# Altium project atWork_Encoder.PrjPcb
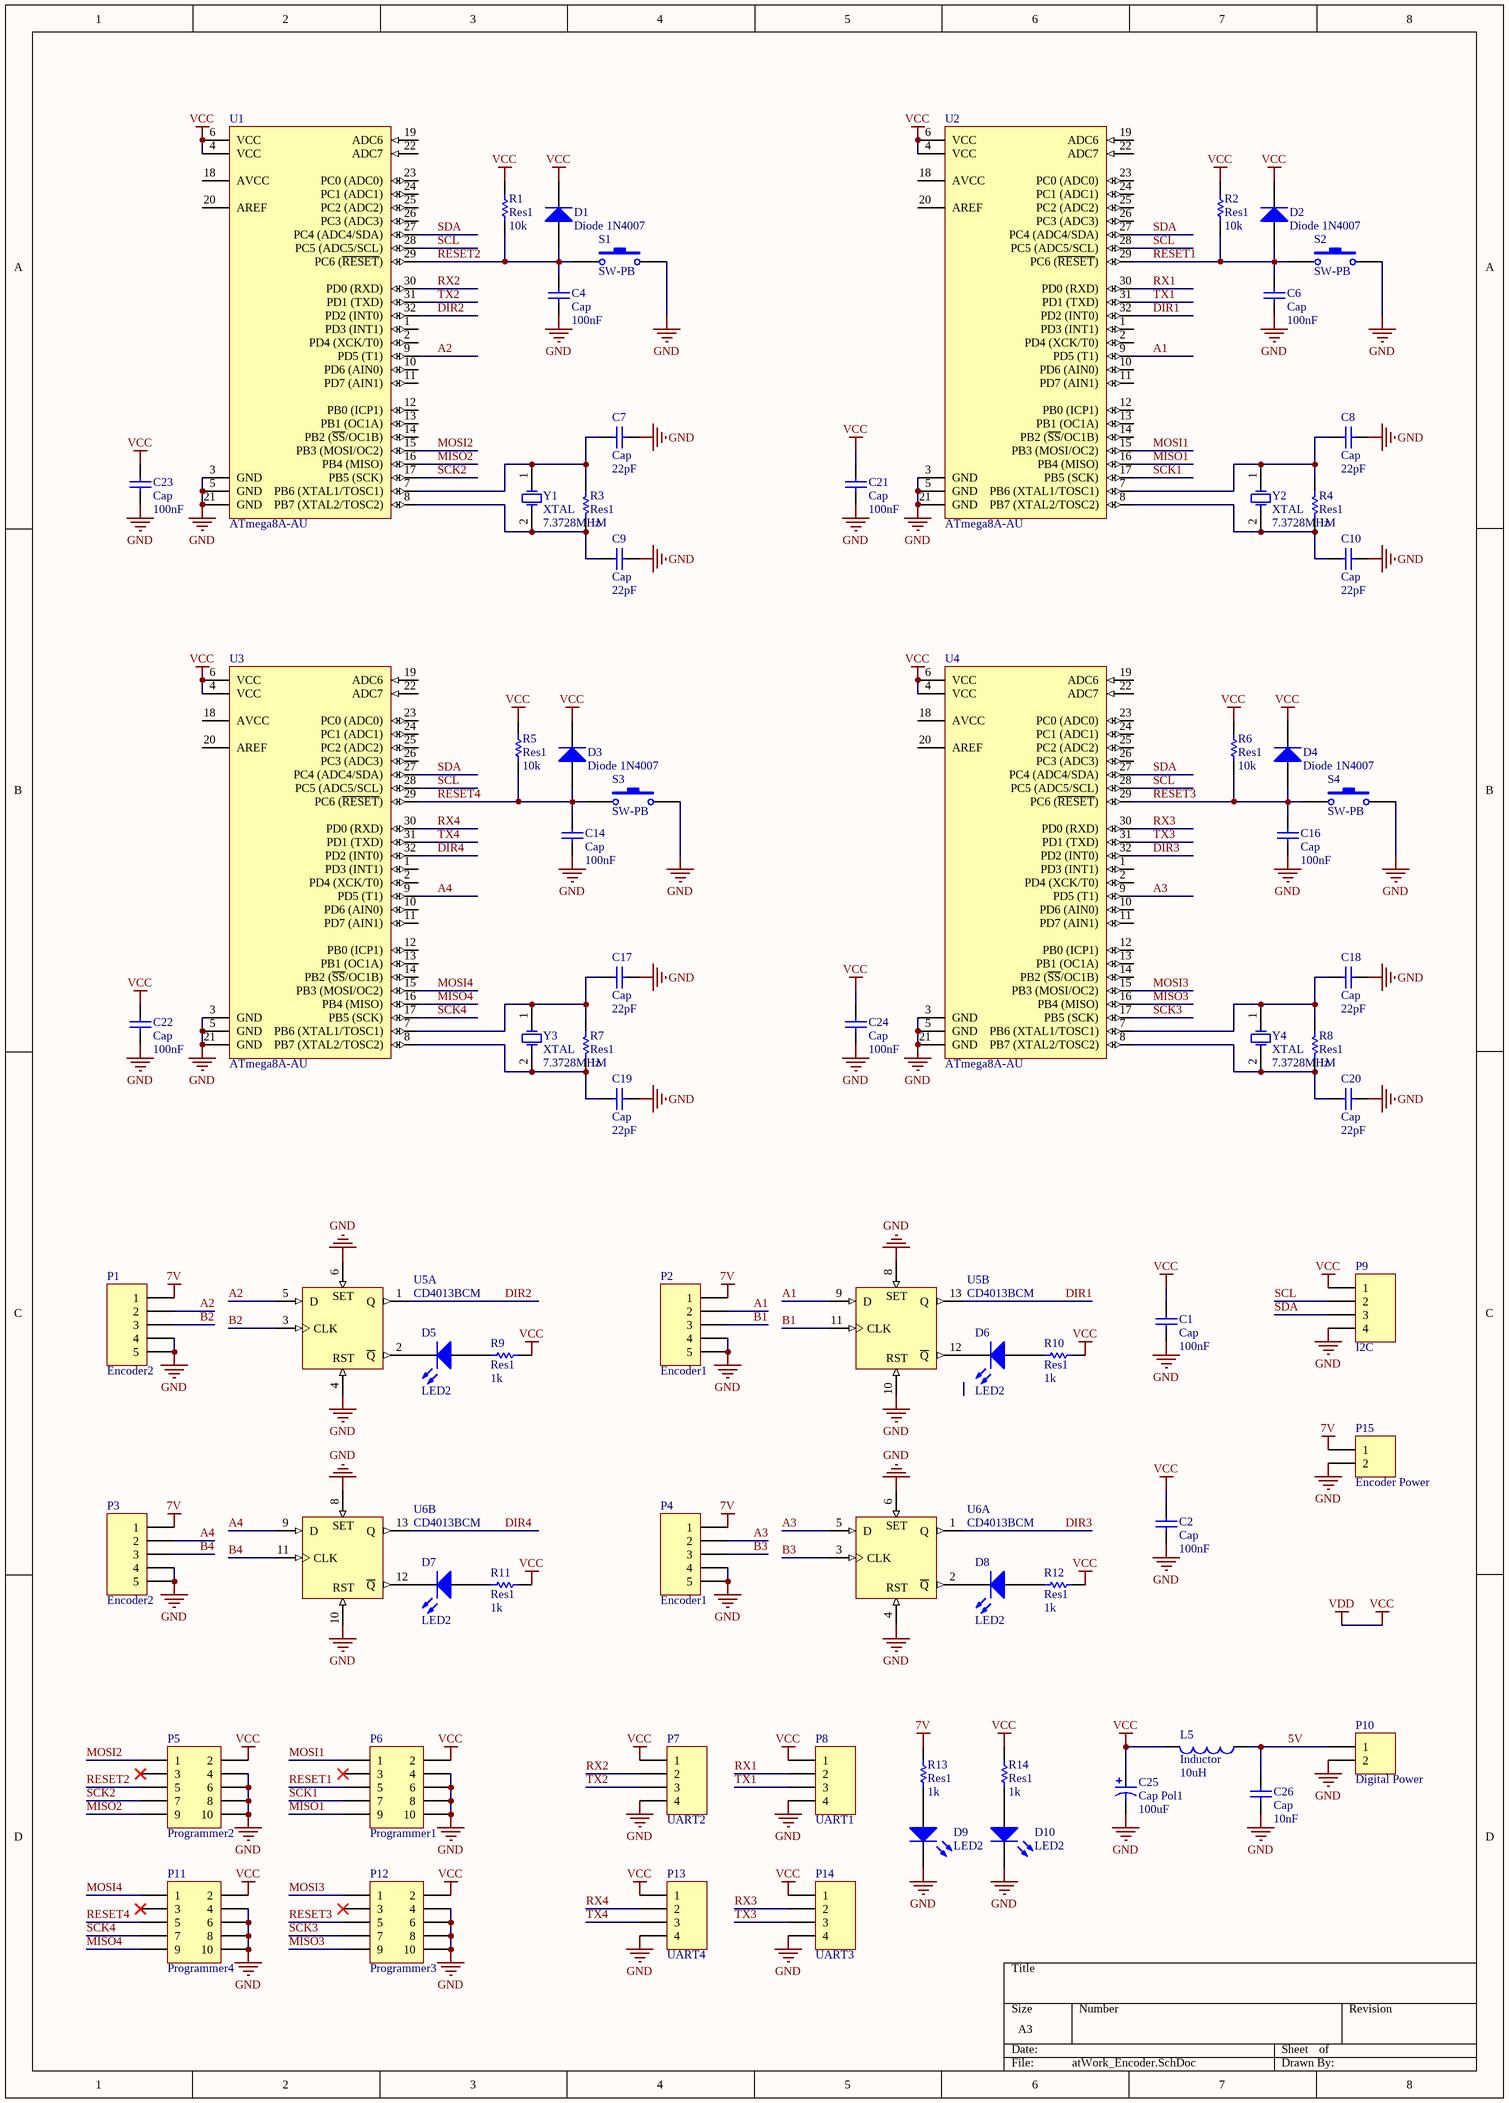
[diagram p0: atWork_Encoder.SchDoc]
1 sheet, 74 parts. Net scope: global (net labels, ports and power ports of the same name join across sheets).
Board file: atWork_Encoder.PcbDoc

## Sheet atWork_Encoder.SchDoc
size A3 portrait

### Parts
C1  Cap  value 100nF  [C1206]
C2  Cap  value 100nF  [C1206]
C4  Cap  value 100nF  [C1206]
C6  Cap  value 100nF  [C1206]
C7  Cap  value 22pF  [C1206]
C8  Cap  value 22pF  [C1206]
C9  Cap  value 22pF  [C1206]
C10  Cap  value 22pF  [C1206]
C14  Cap  value 100nF  [C1206]
C16  Cap  value 100nF  [C1206]
C17  Cap  value 22pF  [C1206]
C18  Cap  value 22pF  [C1206]
C19  Cap  value 22pF  [C1206]
C20  Cap  value 22pF  [C1206]
C21  Cap  value 100nF  [C1206]
C22  Cap  value 100nF  [C1206]
C23  Cap  value 100nF  [C1206]
C24  Cap  value 100nF  [C1206]
C25  Cap Pol1  value 100uF  [CAP-SMD1]
C26  Cap  value 10nF  [C1206]
D1  Diode 1N4007  [DIODE-SMD]
D2  Diode 1N4007  [DIODE-SMD]
D3  Diode 1N4007  [DIODE-SMD]
D4  Diode 1N4007  [DIODE-SMD]
D5  LED2  [3.2X1.6X1.1]
D6  LED2  [3.2X1.6X1.1]
D7  LED2  [3.2X1.6X1.1]
D8  LED2  [3.2X1.6X1.1]
D9  LED2  [3.2X1.6X1.1]
D10  LED2  [3.2X1.6X1.1]
L5  Inductor  value 10uH  [C1206]
P1  Encoder2  [XH5PIN]
P2  Encoder1  [XH5PIN]
P3  Encoder2  [XH5PIN]
P4  Encoder1  [XH5PIN]
P5  Programmer2  [BOX2X5]
P6  Programmer1  [BOX2X5]
P7  UART2  [XH4PIN]
P8  UART1  [XH4PIN]
P9  I2C  [XH4PIN]
P10  Digital Power  [XH2PIN]
P11  Programmer4  [BOX2X5]
P12  Programmer3  [BOX2X5]
P13  UART4  [XH4PIN]
P14  UART3  [XH4PIN]
P15  Encoder Power  [XH2PIN]
R1  Res1  value 10k  [C1206]
R2  Res1  value 10k  [C1206]
R3  Res1  value 1M  [C1206]
R4  Res1  value 1M  [C1206]
R5  Res1  value 10k  [C1206]
R6  Res1  value 10k  [C1206]
R7  Res1  value 1M  [C1206]
R8  Res1  value 1M  [C1206]
R9  Res1  value 1k  [C1206]
R10  Res1  value 1k  [C1206]
R11  Res1  value 1k  [C1206]
R12  Res1  value 1k  [C1206]
R13  Res1  value 1k  [C1206]
R14  Res1  value 1k  [C1206]
S1  SW-PB  [PUSH1]
S2  SW-PB  [PUSH1]
S3  SW-PB  [PUSH1]
S4  SW-PB  [PUSH1]
U1  ATmega8A-AU  [32A_M]
U2  ATmega8A-AU  [32A_M]
U3  ATmega8A-AU  [32A_M]
U4  ATmega8A-AU  [32A_M]
U5  CD4013BCM  [M14A_M]  (parts A,B of 2)
U6  CD4013BCM  [M14A_M]  (parts A,B of 2)
Y1  XTAL  value 7.3728MHz  [XTAL]
Y2  XTAL  value 7.3728MHz  [XTAL]
Y3  XTAL  value 7.3728MHz  [XTAL]
Y4  XTAL  value 7.3728MHz  [XTAL]

### Nets
7V: P1.1 P2.1 P3.1 P4.1 P15.1 R13.2
GND: C1.1 C2.1 C4.1 C6.1 C7.1 C8.1 C9.1 C10.1 C14.1 C16.1 C17.1 C18.1 C19.1 C20.1 C21.1 C22.1 C23.1 C24.1 C25.2 C26.1 D9.2(K) D10.2(K) P1.4 P1.5 P2.4 P2.5 P3.4 P3.5 P4.4 P4.5 P5.4 P5.6 P5.8 P5.10 P6.4 P6.6 P6.8 P6.10 P7.4 P8.4 P9.4 P10.2 P11.4 P11.6 P11.8 P11.10 P12.4 P12.6 P12.8 P12.10 P13.4 P14.4 P15.2 S1.2 S2.2 S3.2 S4.2 U1.3(GND) U1.5(GND) U1.21(GND) U2.3(GND) U2.5(GND) U2.21(GND) U3.3(GND) U3.5(GND) U3.21(GND) U4.3(GND) U4.5(GND) U4.21(GND) U5.4(RST) U5.6(S) U5.7(GND) U5.8(S) U5.10(RST) U6.4(RST) U6.6(S) U6.7(GND) U6.8(S) U6.10(RST)
VCC: C1.2 C2.2 C21.2 C22.2 C23.2 C24.2 C25.1 D1.2(K) D2.2(K) D3.2(K) D4.2(K) L5.2 P5.2 P6.2 P7.1 P8.1 P9.1 P11.2 P12.2 P13.1 P14.1 R1.1 R2.1 R5.1 R6.1 R9.1 R10.1 R11.1 R12.1 R14.2 U1.4(VCC) U1.6(VCC) U2.4(VCC) U2.6(VCC) U3.4(VCC) U3.6(VCC) U4.4(VCC) U4.6(VCC) U5.14(VDD) U6.14(VDD)  [also labelled VDD]
5V: C26.2 L5.1 P10.1
A1: P2.2 U2.9(PD5_(T1)) U5.9(D)
A2: P1.2 U1.9(PD5_(T1)) U5.5(D)
A3: P4.2 U4.9(PD5_(T1)) U6.5(D)
A4: P3.2 U3.9(PD5_(T1)) U6.9(D)
B1: P2.3 U5.11(CLK)
B2: P1.3 U5.3(CLK)
B3: P4.3 U6.3(CLK)
B4: P3.3 U6.11(CLK)
DIR1: U2.32(PD2_(INT0)) U5.13(Q)
DIR2: U1.32(PD2_(INT0)) U5.1(Q)
DIR3: U4.32(PD2_(INT0)) U6.1(Q)
DIR4: U3.32(PD2_(INT0)) U6.13(Q)
MISO1: P6.9 U2.16(PB4_(MISO))
MISO2: P5.9 U1.16(PB4_(MISO))
MISO3: P12.9 U4.16(PB4_(MISO))
MISO4: P11.9 U3.16(PB4_(MISO))
MOSI1: P6.1 U2.15(PB3_(MOSI/OC2))
MOSI2: P5.1 U1.15(PB3_(MOSI/OC2))
MOSI3: P12.1 U4.15(PB3_(MOSI/OC2))
MOSI4: P11.1 U3.15(PB3_(MOSI/OC2))
RESET1: C6.2 D2.1(A) P6.5 R2.2 S2.1 U2.29(PC6_(~{RESET}))
RESET2: C4.2 D1.1(A) P5.5 R1.2 S1.1 U1.29(PC6_(~{RESET}))
RESET3: C16.2 D4.1(A) P12.5 R6.2 S4.1 U4.29(PC6_(~{RESET}))
RESET4: C14.2 D3.1(A) P11.5 R5.2 S3.1 U3.29(PC6_(~{RESET}))
RX1: P8.2 U2.30(PD0_(RXD))
RX2: P7.2 U1.30(PD0_(RXD))
RX3: P14.2 U4.30(PD0_(RXD))
RX4: P13.2 U3.30(PD0_(RXD))
SCK1: P6.7 U2.17(PB5_(SCK))
SCK2: P5.7 U1.17(PB5_(SCK))
SCK3: P12.7 U4.17(PB5_(SCK))
SCK4: P11.7 U3.17(PB5_(SCK))
SCL: P9.2 U1.28(PC5_(ADC5/SCL)) U2.28(PC5_(ADC5/SCL)) U3.28(PC5_(ADC5/SCL)) U4.28(PC5_(ADC5/SCL))
SDA: P9.3 U1.27(PC4_(ADC4/SDA)) U2.27(PC4_(ADC4/SDA)) U3.27(PC4_(ADC4/SDA)) U4.27(PC4_(ADC4/SDA))
TX1: P8.3 U2.31(PD1_(TXD))
TX2: P7.3 U1.31(PD1_(TXD))
TX3: P14.3 U4.31(PD1_(TXD))
TX4: P13.3 U3.31(PD1_(TXD))
NetC7_2: C7.2 R3.2 U1.7(PB6_(XTAL1/TOSC1)) Y1.1(OSC1)
NetC8_2: C8.2 R4.2 U2.7(PB6_(XTAL1/TOSC1)) Y2.1(OSC1)
NetC9_2: C9.2 R3.1 U1.8(PB7_(XTAL2/TOSC2)) Y1.2(OSC2)
NetC10_2: C10.2 R4.1 U2.8(PB7_(XTAL2/TOSC2)) Y2.2(OSC2)
NetC17_2: C17.2 R7.2 U3.7(PB6_(XTAL1/TOSC1)) Y3.1(OSC1)
NetC18_2: C18.2 R8.2 U4.7(PB6_(XTAL1/TOSC1)) Y4.1(OSC1)
NetC19_2: C19.2 R7.1 U3.8(PB7_(XTAL2/TOSC2)) Y3.2(OSC2)
NetC20_2: C20.2 R8.1 U4.8(PB7_(XTAL2/TOSC2)) Y4.2(OSC2)
NetD5_1: D5.1(A) R9.2
NetD5_2: D5.2(K) U5.2(~{Q})
NetD6_1: D6.1(A) R10.2
NetD6_2: D6.2(K) U5.12(~{Q})
NetD7_1: D7.1(A) R11.2
NetD7_2: D7.2(K) U6.12(~{Q})
NetD8_1: D8.1(A) R12.2
NetD8_2: D8.2(K) U6.2(~{Q})
NetD9_1: D9.1(A) R13.1
NetD10_1: D10.1(A) R14.1

Not connected (* = marked no-connect by the designer): P5 3*; P6 3*; P11 3*; P12 3*; U1 1(PD3_(INT1)) 2(PD4_(XCK/T0)) 10(PD6_(AIN0)) 11(PD7_(AIN1)) 12(PB0_(ICP1)) 13(PB1_(OC1A)) 14(PB2_(~{SS}/OC1B)) 18(AVCC) 19(ADC6) 20(AREF) 22(ADC7) 23(PC0_(ADC0)) 24(PC1_(ADC1)) 25(PC2_(ADC2)) 26(PC3_(ADC3)); U2 1(PD3_(INT1)) 2(PD4_(XCK/T0)) 10(PD6_(AIN0)) 11(PD7_(AIN1)) 12(PB0_(ICP1)) 13(PB1_(OC1A)) 14(PB2_(~{SS}/OC1B)) 18(AVCC) 19(ADC6) 20(AREF) 22(ADC7) 23(PC0_(ADC0)) 24(PC1_(ADC1)) 25(PC2_(ADC2)) 26(PC3_(ADC3)); U3 1(PD3_(INT1)) 2(PD4_(XCK/T0)) 10(PD6_(AIN0)) 11(PD7_(AIN1)) 12(PB0_(ICP1)) 13(PB1_(OC1A)) 14(PB2_(~{SS}/OC1B)) 18(AVCC) 19(ADC6) 20(AREF) 22(ADC7) 23(PC0_(ADC0)) 24(PC1_(ADC1)) 25(PC2_(ADC2)) 26(PC3_(ADC3)); U4 1(PD3_(INT1)) 2(PD4_(XCK/T0)) 10(PD6_(AIN0)) 11(PD7_(AIN1)) 12(PB0_(ICP1)) 13(PB1_(OC1A)) 14(PB2_(~{SS}/OC1B)) 18(AVCC) 19(ADC6) 20(AREF) 22(ADC7) 23(PC0_(ADC0)) 24(PC1_(ADC1)) 25(PC2_(ADC2)) 26(PC3_(ADC3))

### Notes on the sheet
- (in symbol CD4013BCM, part A) SET
- (in symbol CD4013BCM, part B) SET

### Library data of the parts
C1 C2 C4 C6-C10 C14 C16-C24 C26 = Cap: Capacitor; Published: 8-Jun-2000; LatestRevisionDate: 17-Jul-2002; LatestRevisionNote: Re-released for DXP Platform.; PackageReference: RAD-0.3; Publisher: Altium Limited; PackageDescription: Radial Cap, Thru-Hole; 2 Leads; 0.3 in Pin Spacing
C25 = Cap Pol1: Polarized Capacitor (Radial); Published: 8-Jun-2000; LatestRevisionDate: 17-Jul-2002; LatestRevisionNote: Re-released for DXP Platform.; PackageReference: RB7.6-15; Publisher: Altium Limited; PackageDescription: Polarized Capacitor (Radial); 2 Leads
D1-D4 = Diode 1N4007: 1 Amp General Purpose Rectifier; Published: 8-Jun-2000; LatestRevisionDate: 17-Jul-2002; LatestRevisionNote: Re-released for DXP Platform.; DatasheetVersion: 1998; PackageVersion: Aug-1999; PackageReference: DO-41; Publisher: Altium Limited; PackageDescription: Diode, Axial; Body 5.2 x 2.7 mm (LxDia. max), Lead Dia. 0.86 mm (max); Code_JEDEC: DO-204-AL; ComponentLink1Description: Manufacturer Link; ComponentLink1URL: http://www.fairchildsemi.com/; ComponentLink2Description: Datasheet; ComponentLink2URL: http://www.fairchildsemi.com/ds/1N%2F1N4001.pdf
D5-D10 = LED2: Typical RED, GREEN, YELLOW, AMBER GaAs LED; Published: 8-Jun-2000; LatestRevisionDate: 17-Jul-2002; LatestRevisionNote: Re-released for DXP Platform.; PackageVersion: Feb-2002; PackageReference: 3.2X1.6X1.1; Publisher: Altium Limited; PackageDescription: SM LED; 2 Flat Leads
L5 = Inductor: Code_IEC: 1005; Published: 8-Jun-2000; LatestRevisionDate: 29-May-2009; LatestRevisionNote: IPC-7351 Footprint Added.; PackageReference: 0402-A; Publisher: Altium Limited; PackageDescription: Chip Inductor; Code_JEITA: 0402
P1-P4 = Header 5: Header, 5-Pin; LatestRevisionDate: 17-Jul-2002; LatestRevisionNote: Re-released for DXP Platform.; Publisher: Altium Limited
P5 P6 P11 P12 = Box 5X2: Box, 5-Pin, Dual row; Designer: Meysam Parvizi; Email: meysam.parvizi.ir@gmail.com; Weblog: http://mp.tabin.ir
P7-P9 P13 P14 = Header 4: Header, 4-Pin; LatestRevisionDate: 17-Jul-2002; LatestRevisionNote: Re-released for DXP Platform.; Publisher: Altium Limited
P10 P15 = Header 2: Header, 2-Pin; LatestRevisionDate: 17-Jul-2002; LatestRevisionNote: Re-released for DXP Platform.; Publisher: Altium Limited
R1-R14 = Res1: Resistor; Published: 8-Jun-2000; LatestRevisionDate: 17-Jul-2002; LatestRevisionNote: Re-released for DXP Platform.; PackageReference: AXIAL-0.3; Publisher: Altium Limited; PackageDescription: Axial Device, Thru-Hole; 2 Leads; 0.3 in Pin Spacing
S1-S4 = SW-PB: Switch; Published: 24-Mar-1999; LatestRevisionDate: 17-Jul-2002; LatestRevisionNote: Re-released for DXP Platform.; PackageReference: SPST-2; Publisher: Altium Limited; PackageDescription: Switch; 2 Leads
U1-U4 = ATmega8A-AU: 8-bit AVR Microcontroller, 8KB Flash, 512 Bytes EEPROM, 1KB SRAM, 32-pin TQFP, Industrial Grade (-40°C to 85°C); Published: 1-Apr-2010; DatasheetVersion: revC, Jul-2009; PackageVersion: revB, Oct-2001; PackageReference: 32A; Publisher: Altium Limited; PackageDescription: 32-Lead, 7x7x1.0 mm Body, 0.8mm Lead Pitch, Thin Profile Plastic Quad Flat Package (TQFP); Supplier 1: Digi-Key; Supplier Part Number 1: ATMEGA8A-AU-ND; Supplier 2: Farnell; Supplier Part Number 2: 1748532; Supplier 3: Mouser; Supplier Part Number 3: 556-ATMEGA8A-AU; Code_JEDEC: MS-026-ABA; ComponentLink1Description: Manufacturer Link; ComponentLink1URL: http://www.atmel.com/products/avr/default.asp?; ComponentLink2Description: ATmega8A Datasheet; ComponentLink2URL: http://www.atmel.com/dyn/resources/prod_documents/doc8159.pdf; ComponentLink3Description: ATmega8A Summary; ComponentLink3URL: http://www.atmel.com/dyn/resources/prod_documents/8159S.pdf; ComponentLink4Description: Atmel.com Home; ComponentLink4URL: http://www.atmel.com
U5 U6 = CD4013BCM: Dual D-Type Flip-Flop; Published: 17-Jul-2002; LatestRevisionDate: 13-Apr-2006; LatestRevisionNote: IPC-7351 Footprint Added.; DatasheetVersion: Jan-1999; PackageVersion: 2000; PackageReference: M14A; Publisher: Altium Limited; PackageDescription: 14-Pin Small Outline Integrated Circuit 1.27 mm Pitch; Code_IPC: SOIC127P600-14; ComponentLink1Description: Manufacturer Link; ComponentLink1URL: http://www.fairchildsemi.com/
Y1-Y4 = XTAL: Crystal Oscillator; Designer: Meysam Parvizi; Email: meysam.parvizi.ir@gmail.com; Weblog: http://mp.tabin.ir